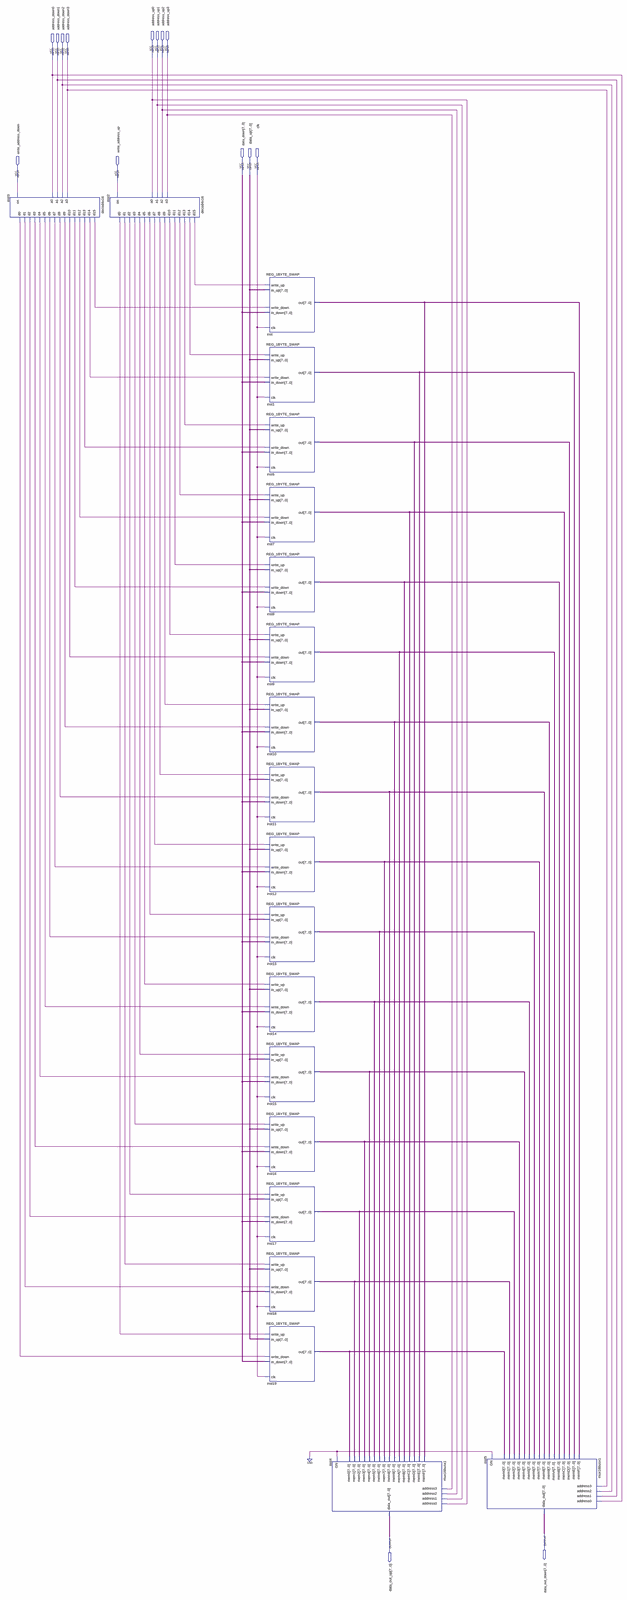
[diagram p0: schematic sheet, whole]
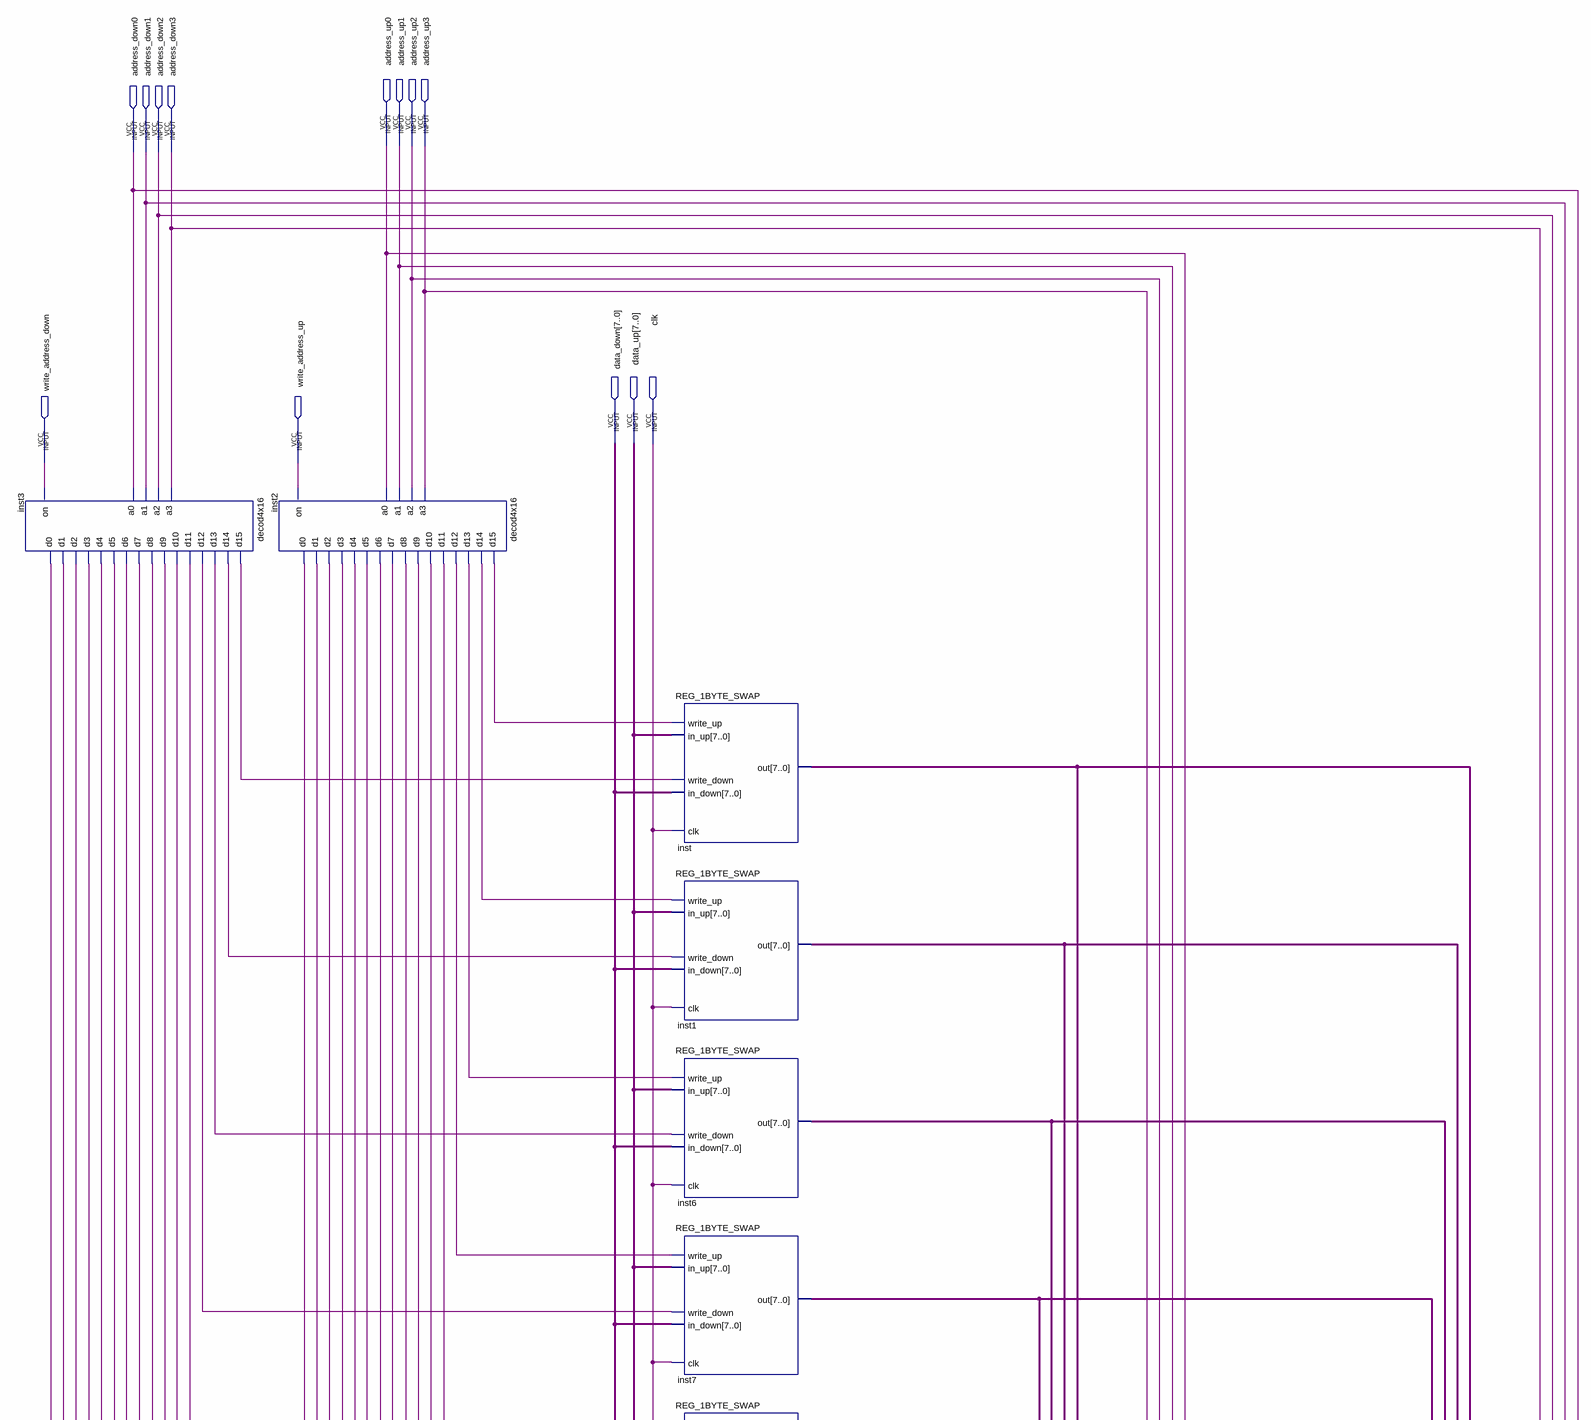
[diagram p1: schematic sheet, upper part]
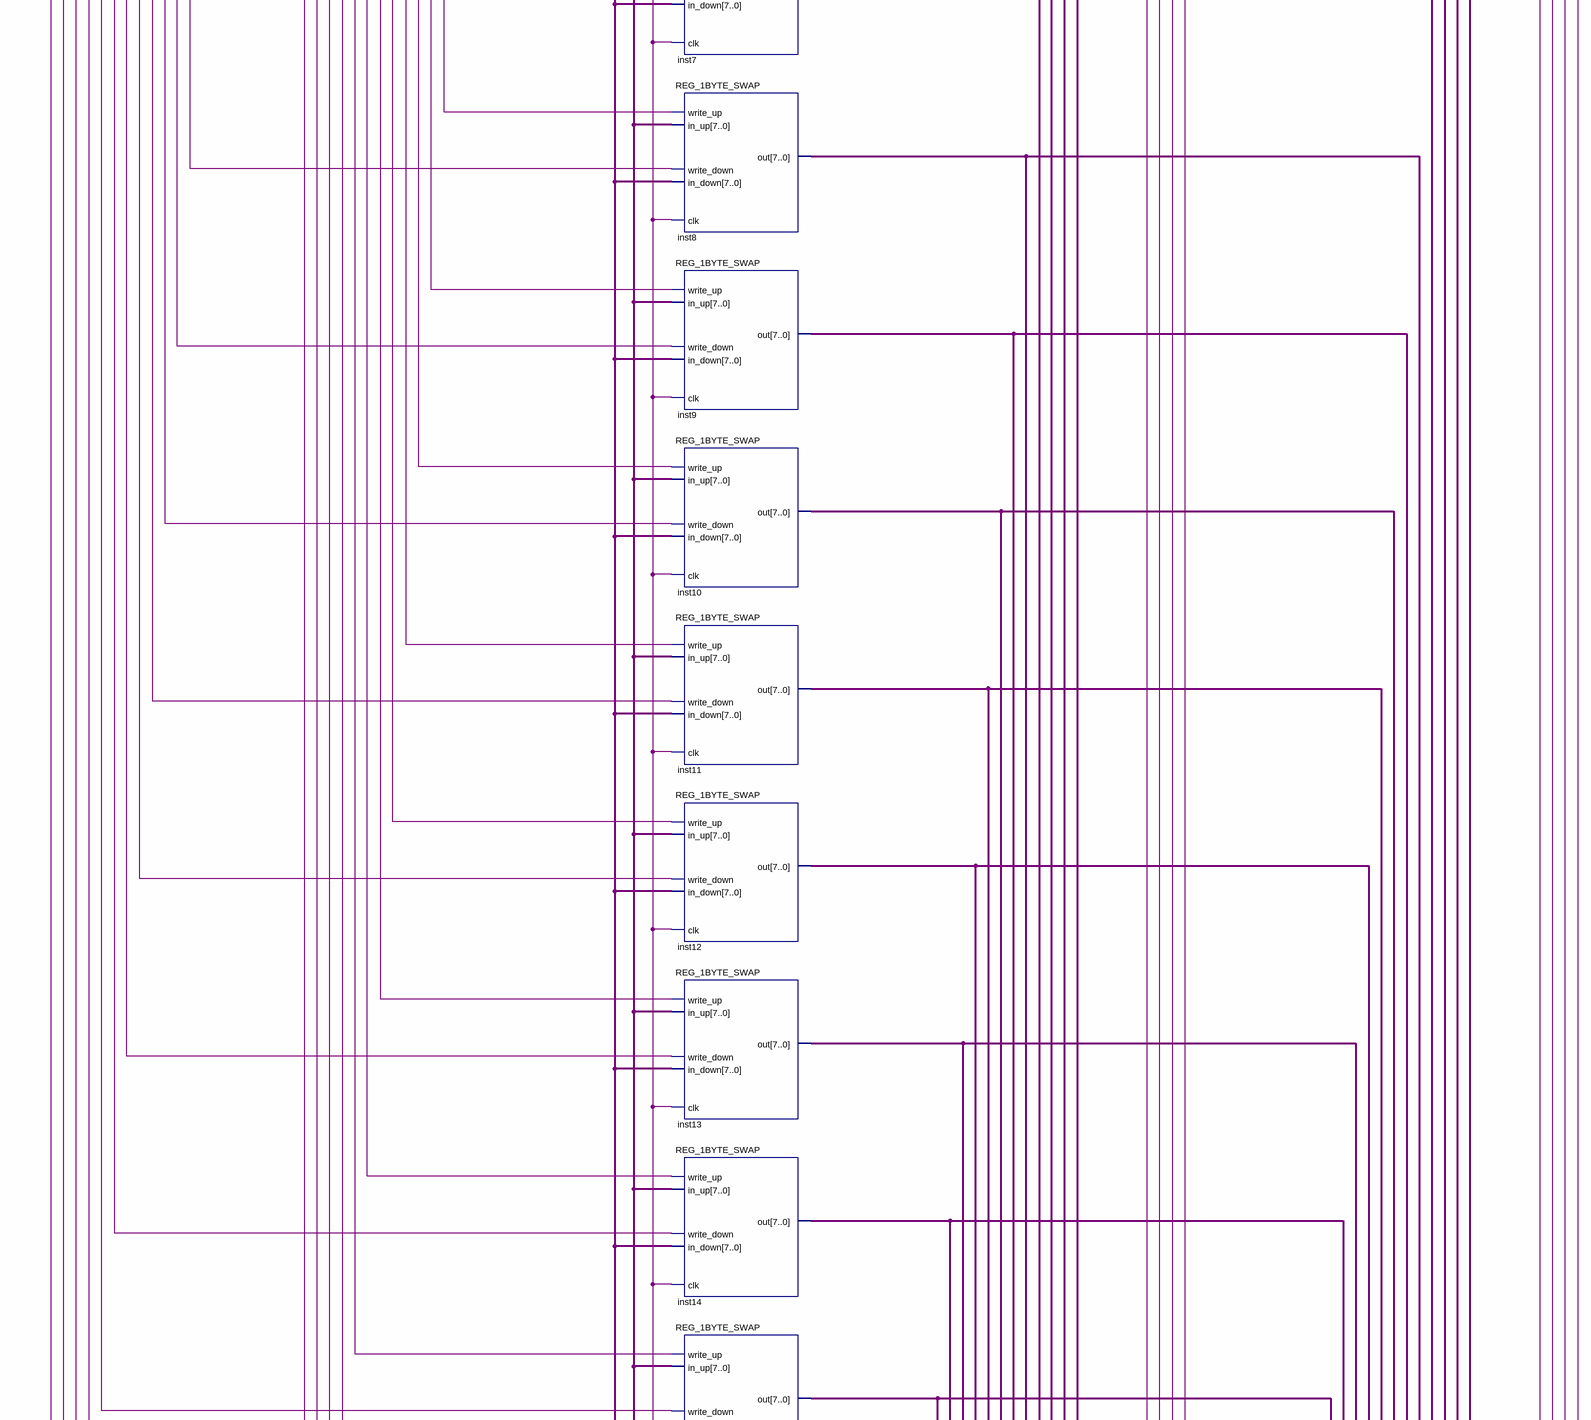
[diagram p2: schematic sheet, middle part]
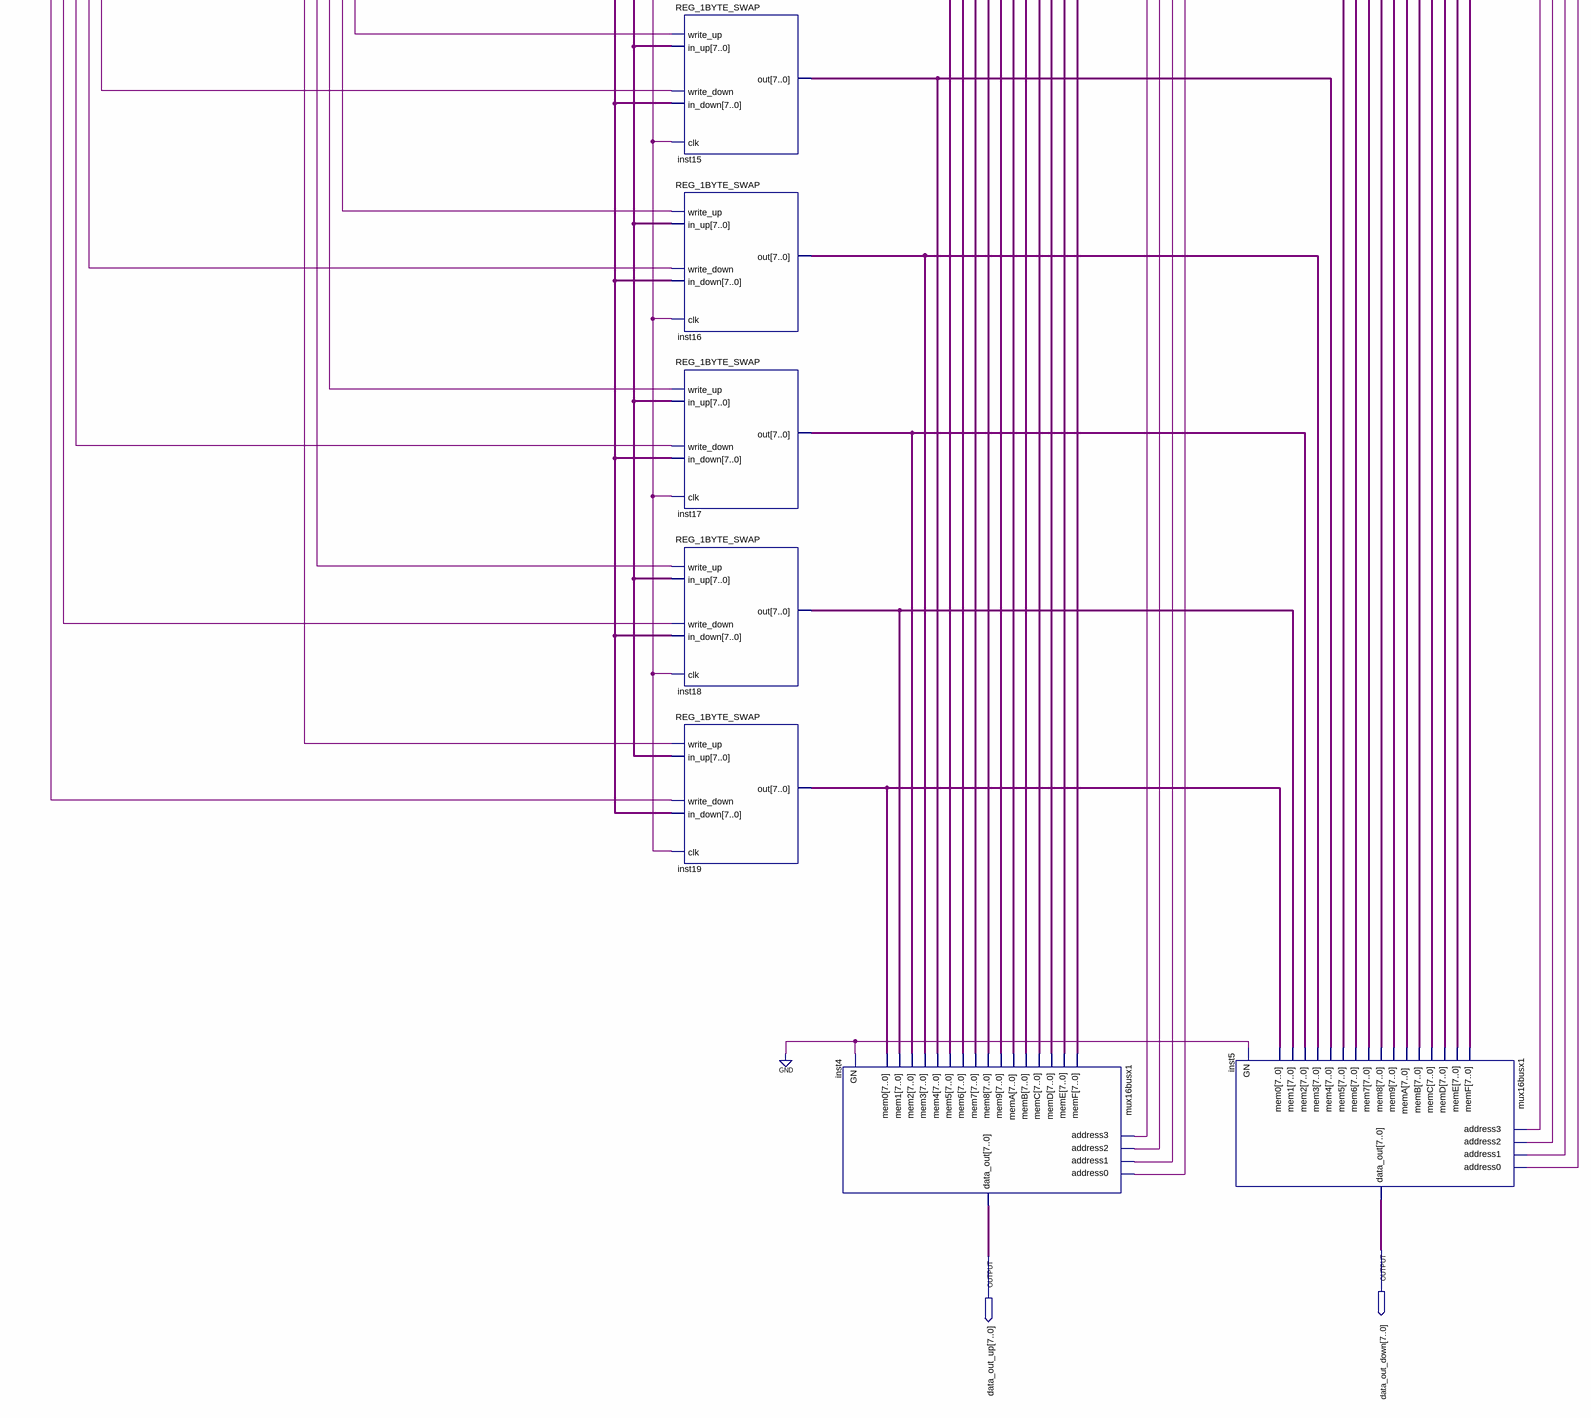
[diagram p3: schematic sheet, lower part]
// Quartus schematic MEM_16ADD_SWAP.bdf as structural Verilog: 20 symbols, 15 pins
module MEM_16ADD_SWAP (
  input  address_up0,
  input  address_up1,
  input  address_up2,
  input  address_up3,
  input  address_down0,
  input  address_down1,
  input  address_down2,
  input  address_down3,
  input  [7:0] data_down,
  input  [7:0] data_up,
  input  clk,
  input  write_address_down,
  input  write_address_up,
  output [7:0] data_out_down,
  output [7:0] data_out_up
);

  wire inst2_d0, inst2_d1, inst2_d2, inst2_d3, inst2_d4, inst2_d5, inst2_d6, inst2_d7, inst2_d8, inst2_d9,
       inst2_d10, inst2_d11, inst2_d12, inst2_d13, inst2_d14, inst2_d15, inst3_d0, inst3_d1, inst3_d2,
       inst3_d3, inst3_d4, inst3_d5, inst3_d6, inst3_d7, inst3_d8, inst3_d9, inst3_d10, inst3_d11, inst3_d12,
       inst3_d13, inst3_d14, inst3_d15;
  wire [7:0] inst1_out, inst6_out, inst7_out, inst8_out, inst9_out, inst10_out, inst11_out, inst12_out,
       inst13_out, inst14_out, inst15_out, inst16_out, inst17_out, inst18_out, inst19_out, inst_out;

  decod4x16 inst3 (
    .a3(address_down3), .a2(address_down2), .on(write_address_down), .a1(address_down1), .a0(address_down0),
    .d15(inst3_d15), .d14(inst3_d14), .d13(inst3_d13), .d12(inst3_d12), .d11(inst3_d11), .d10(inst3_d10),
    .d9(inst3_d9), .d8(inst3_d8), .d7(inst3_d7), .d6(inst3_d6), .d5(inst3_d5), .d4(inst3_d4), .d3(inst3_d3),
    .d2(inst3_d2), .d1(inst3_d1), .d0(inst3_d0));
  decod4x16 inst2 (
    .a3(address_up3), .a2(address_up2), .on(write_address_up), .a1(address_up1), .a0(address_up0),
    .d15(inst2_d15), .d14(inst2_d14), .d13(inst2_d13), .d12(inst2_d12), .d11(inst2_d11), .d10(inst2_d10),
    .d9(inst2_d9), .d8(inst2_d8), .d7(inst2_d7), .d6(inst2_d6), .d5(inst2_d5), .d4(inst2_d4), .d3(inst2_d3),
    .d2(inst2_d2), .d1(inst2_d1), .d0(inst2_d0));
  REG_1BYTE_SWAP inst (
    .write_up(inst2_d15), .write_down(inst3_d15), .in_down(data_down), .in_up(data_up), .clk(clk),
    .out(inst_out));
  REG_1BYTE_SWAP inst1 (
    .write_up(inst2_d14), .write_down(inst3_d14), .in_down(data_down), .in_up(data_up), .clk(clk),
    .out(inst1_out));
  REG_1BYTE_SWAP inst6 (
    .write_up(inst2_d13), .write_down(inst3_d13), .in_down(data_down), .in_up(data_up), .clk(clk),
    .out(inst6_out));
  REG_1BYTE_SWAP inst7 (
    .write_up(inst2_d12), .write_down(inst3_d12), .in_down(data_down), .in_up(data_up), .clk(clk),
    .out(inst7_out));
  REG_1BYTE_SWAP inst8 (
    .write_up(inst2_d11), .write_down(inst3_d11), .in_down(data_down), .in_up(data_up), .clk(clk),
    .out(inst8_out));
  REG_1BYTE_SWAP inst9 (
    .write_up(inst2_d10), .write_down(inst3_d10), .in_down(data_down), .in_up(data_up), .clk(clk),
    .out(inst9_out));
  REG_1BYTE_SWAP inst10 (
    .write_up(inst2_d9), .write_down(inst3_d9), .in_down(data_down), .in_up(data_up), .clk(clk),
    .out(inst10_out));
  REG_1BYTE_SWAP inst11 (
    .write_up(inst2_d8), .write_down(inst3_d8), .in_down(data_down), .in_up(data_up), .clk(clk),
    .out(inst11_out));
  REG_1BYTE_SWAP inst12 (
    .write_up(inst2_d7), .write_down(inst3_d7), .in_down(data_down), .in_up(data_up), .clk(clk),
    .out(inst12_out));
  REG_1BYTE_SWAP inst13 (
    .write_up(inst2_d6), .write_down(inst3_d6), .in_down(data_down), .in_up(data_up), .clk(clk),
    .out(inst13_out));
  REG_1BYTE_SWAP inst14 (
    .write_up(inst2_d5), .write_down(inst3_d5), .in_down(data_down), .in_up(data_up), .clk(clk),
    .out(inst14_out));
  REG_1BYTE_SWAP inst15 (
    .write_up(inst2_d4), .write_down(inst3_d4), .in_down(data_down), .in_up(data_up), .clk(clk),
    .out(inst15_out));
  REG_1BYTE_SWAP inst16 (
    .write_up(inst2_d3), .write_down(inst3_d3), .in_down(data_down), .in_up(data_up), .clk(clk),
    .out(inst16_out));
  REG_1BYTE_SWAP inst17 (
    .write_up(inst2_d2), .write_down(inst3_d2), .in_down(data_down), .in_up(data_up), .clk(clk),
    .out(inst17_out));
  REG_1BYTE_SWAP inst18 (
    .write_up(inst2_d1), .write_down(inst3_d1), .in_down(data_down), .in_up(data_up), .clk(clk),
    .out(inst18_out));
  REG_1BYTE_SWAP inst19 (
    .write_up(inst2_d0), .write_down(inst3_d0), .in_down(data_down), .in_up(data_up), .clk(clk),
    .out(inst19_out));
  mux16busx1 inst4 (
    .memF(inst_out), .memE(inst1_out), .memD(inst6_out), .memC(inst7_out), .memB(inst8_out),
    .memA(inst9_out), .mem9(inst10_out), .mem8(inst11_out), .mem7(inst12_out), .mem6(inst13_out),
    .mem5(inst14_out), .mem4(inst15_out), .mem3(inst16_out), .mem2(inst17_out), .mem1(inst18_out),
    .mem0(inst19_out), .GN(1'b0), .address0(address_up0), .address1(address_up1), .address2(address_up2),
    .address3(address_up3), .data_out(data_out_up));
  mux16busx1 inst5 (
    .memF(inst_out), .memE(inst1_out), .memD(inst6_out), .memC(inst7_out), .memB(inst8_out),
    .memA(inst9_out), .mem9(inst10_out), .mem8(inst11_out), .mem7(inst12_out), .mem6(inst13_out),
    .mem5(inst14_out), .mem4(inst15_out), .mem3(inst16_out), .mem2(inst17_out), .mem1(inst18_out),
    .mem0(inst19_out), .GN(1'b0), .address0(address_down0), .address1(address_down1),
    .address2(address_down2), .address3(address_down3), .data_out(data_out_down));
endmodule
